# Altium schematic sheet STM32F103ZET6.SchDoc: STM32F103ZET6最小系统
size A3; CheckedBy: 罗琪; Author: 罗琪; DrawnBy: 罗琪; Engineer: 罗琪; Organization: HUNTERS; DocumentNumber: 2; Revision: 1.0; SheetNumber: 2; SheetTotal: 4; Time: 2018/11/2
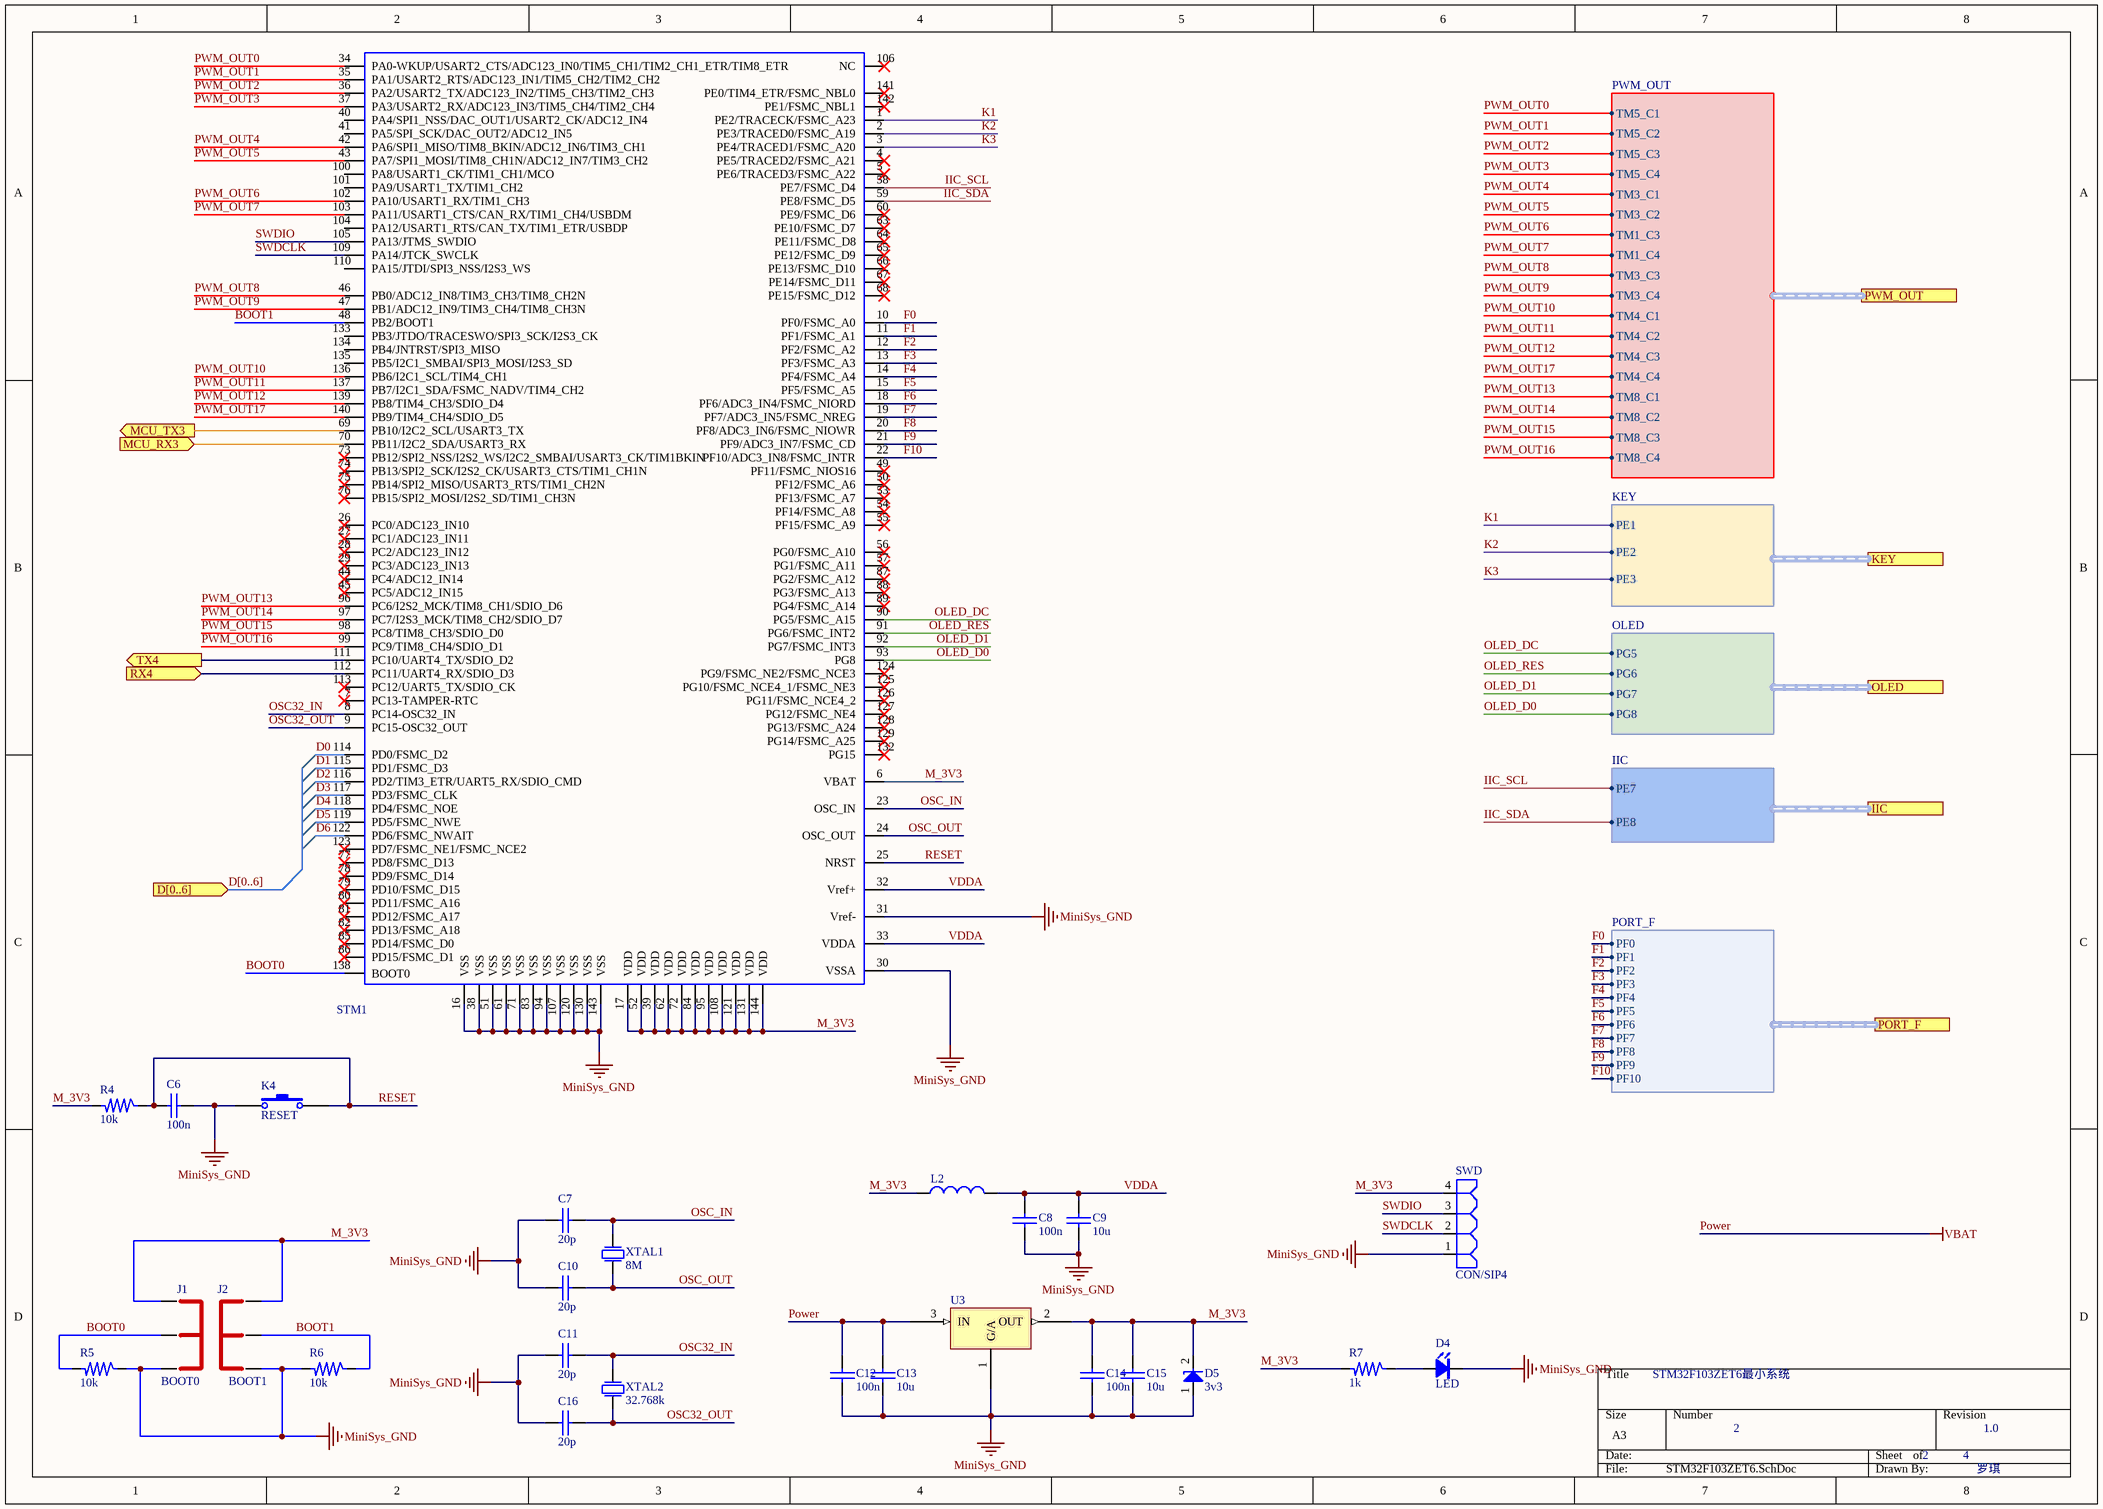
[diagram p0: STM32F103ZET6.SchDoc]

## Parts
C6  100n  [C0402]
C7  20p  [C0402]
C8  100n  [C0402]
C9  10u  [C0402]
C10  20p  [C0402]
C11  20p  [C0402]
C12  100n  [C0402]
C13  10u  [C0402]
C14  100n  [C0402]
C15  10u  [C0402]
C16  20p  [C0402]
D4  LED  [LED0805TB]
D5  3v3  [D1206]
J1  BOOT0  [Jumper3]
J2  BOOT1  [Jumper3]
K4  RESET  [按键-贴片-1]
L2  INDUCTOR  [L0805]  (value not drawn)
R4  10k  [R0805]
R5  10k  [R0805]
R6  10k  [R0805]
R7  1k  [R0805]
STM1  STM32F103ZET6  [STM32F103ZET6-1]  (value not drawn)
SWD  CON/SIP4  [HDR1X4]
U3  AMS1117-XX  [SOT223]  (value not drawn)
XTAL1  8M  [XTAL-49/S_N]
XTAL2  32.768k  [XTAL_32.768]

## Ports
D[0..6] (in), IIC (harness IIC), KEY (harness KEY), MCU_RX3 (in), MCU_TX3 (out), OLED (harness OLED), PORT_F (harness PORT_F), PWM_OUT (harness PWM_OUT), RX4 (in), TX4 (out)

## Harnesses
PWM_OUT: TM5_C1, TM5_C2, TM5_C3, TM5_C4, TM3_C1, TM3_C2, TM1_C3, TM1_C4, TM3_C3, TM3_C4, TM4_C1, TM4_C2, TM4_C3, TM8_C1, TM8_C2, TM8_C3, TM8_C4, TM4_C4
KEY: PE1, PE2, PE3
OLED: PG5, PG6, PG7, PG8
IIC: PE7, PE8
PORT_F: PF0, PF1, PF2, PF3, PF4, PF5, PF6, PF7, PF8, PF9, PF10

## Nets
MiniSys_GND: C6.2 C7.1 C8.1 C9.1 C10.1 C11.1 C12.1 C13.1 C14.1 C15.1 C16.1 D4.2(K) D5.1 J1.3 J2.1 K4.1 R5.2 R6.1 STM1.16(VSS) STM1.30(VSSA) STM1.31(Vref-) STM1.38(VSS) STM1.51(VSS) STM1.61(VSS) STM1.71(VSS) STM1.83(VSS) STM1.94(VSS) STM1.107(VSS) STM1.120(VSS) STM1.130(VSS) STM1.143(VSS) SWD.1 U3.1(G/A)
Power: C12.2 C13.2 U3.3(IN)  [also labelled VBAT]
BOOT0: J1.2 R5.1 STM1.138(BOOT0)
BOOT1: J2.2 R6.2 STM1.48(PB2/BOOT1)
D0: STM1.114(PD0/FSMC_D2)
D1: STM1.115(PD1/FSMC_D3)
D2: STM1.116(PD2/TIM3_ETR/UART5_RX/SDIO_CMD)
D3: STM1.117(PD3/FSMC_CLK)
D4: STM1.118(PD4/FSMC_NOE)
D5: STM1.119(PD5/FSMC_NWE)
D6: STM1.122(PD6/FSMC_NWAIT)
F0: STM1.10(PF0/FSMC_A0) ; port PORT_F.PF0
F1: STM1.11(PF1/FSMC_A1) ; port PORT_F.PF1
F2: STM1.12(PF2/FSMC_A2) ; port PORT_F.PF2
F3: STM1.13(PF3/FSMC_A3) ; port PORT_F.PF3
F4: STM1.14(PF4/FSMC_A4) ; port PORT_F.PF4
F5: STM1.15(PF5/FSMC_A5) ; port PORT_F.PF5
F6: STM1.18(PF6/ADC3_IN4/FSMC_NIORD) ; port PORT_F.PF6
F7: STM1.19(PF7/ADC3_IN5/FSMC_NREG) ; port PORT_F.PF7
F8: STM1.20(PF8/ADC3_IN6/FSMC_NIOWR) ; port PORT_F.PF8
F9: STM1.21(PF9/ADC3_IN7/FSMC_CD) ; port PORT_F.PF9
F10: STM1.22(PF10/ADC3_IN8/FSMC_INTR) ; port PORT_F.PF10
IIC_SCL: STM1.58(PE7/FSMC_D4) ; port IIC.PE7
IIC_SDA: STM1.59(PE8/FSMC_D5) ; port IIC.PE8
K1: STM1.1(PE2/TRACECK/FSMC_A23) ; port KEY.PE1
K2: STM1.2(PE3/TRACED0/FSMC_A19) ; port KEY.PE2
K3: STM1.3(PE4/TRACED1/FSMC_A20) ; port KEY.PE3
M_3V3: C14.2 C15.2 D5.2 J1.1 J2.3 L2.1 R4.1 R7.1 STM1.6(VBAT) STM1.17(VDD) STM1.39(VDD) STM1.52(VDD) STM1.62(VDD) STM1.72(VDD) STM1.84(VDD) STM1.95(VDD) STM1.108(VDD) STM1.121(VDD) STM1.131(VDD) STM1.144(VDD) SWD.4 U3.2(OUT)
MCU_RX3: STM1.70(PB11/I2C2_SDA/USART3_RX) ; port MCU_RX3
MCU_TX3: STM1.69(PB10/I2C2_SCL/USART3_TX) ; port MCU_TX3
OLED_D0: STM1.93(PG8) ; port OLED.PG8
OLED_D1: STM1.92(PG7/FSMC_INT3) ; port OLED.PG7
OLED_DC: STM1.90(PG5/FSMC_A15) ; port OLED.PG5
OLED_RES: STM1.91(PG6/FSMC_INT2) ; port OLED.PG6
OSC32_IN: C11.2 STM1.8(PC14-OSC32_IN) XTAL2.1(P1)
OSC32_OUT: C16.2 STM1.9(PC15-OSC32_OUT) XTAL2.2(P2)
OSC_IN: C7.2 STM1.23(OSC_IN) XTAL1.1(P1)
OSC_OUT: C10.2 STM1.24(OSC_OUT) XTAL1.2(P2)
PWM_OUT0: STM1.34(PA0-WKUP/USART2_CTS/ADC123_IN0/TIM5_CH1/TIM2_CH1_ETR/TIM8_ETR) ; port PWM_OUT.TM5_C1
PWM_OUT1: STM1.35(PA1/USART2_RTS/ADC123_IN1/TIM5_CH2/TIM2_CH2) ; port PWM_OUT.TM5_C2
PWM_OUT2: STM1.36(PA2/USART2_TX/ADC123_IN2/TIM5_CH3/TIM2_CH3) ; port PWM_OUT.TM5_C3
PWM_OUT3: STM1.37(PA3/USART2_RX/ADC123_IN3/TIM5_CH4/TIM2_CH4) ; port PWM_OUT.TM5_C4
PWM_OUT4: STM1.42(PA6/SPI1_MISO/TIM8_BKIN/ADC12_IN6/TIM3_CH1) ; port PWM_OUT.TM3_C1
PWM_OUT5: STM1.43(PA7/SPI1_MOSI/TIM8_CH1N/ADC12_IN7/TIM3_CH2) ; port PWM_OUT.TM3_C2
PWM_OUT6: STM1.102(PA10/USART1_RX/TIM1_CH3) ; port PWM_OUT.TM1_C3
PWM_OUT7: STM1.103(PA11/USART1_CTS/CAN_RX/TIM1_CH4/USBDM) ; port PWM_OUT.TM1_C4
PWM_OUT8: STM1.46(PB0/ADC12_IN8/TIM3_CH3/TIM8_CH2N) ; port PWM_OUT.TM3_C3
PWM_OUT9: STM1.47(PB1/ADC12_IN9/TIM3_CH4/TIM8_CH3N) ; port PWM_OUT.TM3_C4
PWM_OUT10: STM1.136(PB6/I2C1_SCL/TIM4_CH1) ; port PWM_OUT.TM4_C1
PWM_OUT11: STM1.137(PB7/I2C1_SDA/FSMC_NADV/TIM4_CH2) ; port PWM_OUT.TM4_C2
PWM_OUT12: STM1.139(PB8/TIM4_CH3/SDIO_D4) ; port PWM_OUT.TM4_C3
PWM_OUT13: STM1.96(PC6/I2S2_MCK/TIM8_CH1/SDIO_D6) ; port PWM_OUT.TM8_C1
PWM_OUT14: STM1.97(PC7/I2S3_MCK/TIM8_CH2/SDIO_D7) ; port PWM_OUT.TM8_C2
PWM_OUT15: STM1.98(PC8/TIM8_CH3/SDIO_D0) ; port PWM_OUT.TM8_C3
PWM_OUT16: STM1.99(PC9/TIM8_CH4/SDIO_D1) ; port PWM_OUT.TM8_C4
PWM_OUT17: STM1.140(PB9/TIM4_CH4/SDIO_D5) ; port PWM_OUT.TM4_C4
RESET: C6.1 K4.2 R4.2 STM1.25(NRST)
RX4: STM1.112(PC11/UART4_RX/SDIO_D3) ; port RX4
SWDCLK: STM1.109(PA14/JTCK_SWCLK) SWD.2
SWDIO: STM1.105(PA13/JTMS_SWDIO) SWD.3
TX4: STM1.111(PC10/UART4_TX/SDIO_D2) ; port TX4
VDDA: C8.2 C9.2 L2.2 STM1.32(Vref+) STM1.33(VDDA)
NetD4_1: D4.1(A) R7.2

Not connected (* = marked no-connect by the designer): STM1 4(PE5/TRACED2/FSMC_A21)* 5(PE6/TRACED3/FSMC_A22)* 7(PC13-TAMPER-RTC)* 26(PC0/ADC123_IN10)* 27(PC1/ADC123_IN11)* 28(PC2/ADC123_IN12)* 29(PC3/ADC123_IN13)* 40(PA4/SPI1_NSS/DAC_OUT1/USART2_CK/ADC12_IN4) 41(PA5/SPI_SCK/DAC_OUT2/ADC12_IN5) 44(PC4/ADC12_IN14)* 45(PC5/ADC12_IN15)* 49(PF11/FSMC_NIOS16)* 50(PF12/FSMC_A6)* 53(PF13/FSMC_A7)* 54(PF14/FSMC_A8)* 55(PF15/FSMC_A9)* 56(PG0/FSMC_A10)* 57(PG1/FSMC_A11)* 60(PE9/FSMC_D6)* 63(PE10/FSMC_D7)* 64(PE11/FSMC_D8)* 65(PE12/FSMC_D9)* 66(PE13/FSMC_D10)* 67(PE14/FSMC_D11)* 68(PE15/FSMC_D12)* 73(PB12/SPI2_NSS/I2S2_WS/I2C2_SMBAI/USART3_CK/TIM1BKIN)* 74(PB13/SPI2_SCK/I2S2_CK/USART3_CTS/TIM1_CH1N)* 75(PB14/SPI2_MISO/USART3_RTS/TIM1_CH2N)* 76(PB15/SPI2_MOSI/I2S2_SD/TIM1_CH3N)* 77(PD8/FSMC_D13)* 78(PD9/FSMC_D14)* 79(PD10/FSMC_D15)* 80(PD11/FSMC_A16)* 81(PD12/FSMC_A17)* 82(PD13/FSMC_A18)* 85(PD14/FSMC_D0)* 86(PD15/FSMC_D1)* 87(PG2/FSMC_A12)* 88(PG3/FSMC_A13)* 89(PG4/FSMC_A14)* 100(PA8/USART1_CK/TIM1_CH1/MCO) 101(PA9/USART1_TX/TIM1_CH2) 104(PA12/USART1_RTS/CAN_TX/TIM1_ETR/USBDP) 106(NC)* 110(PA15/JTDI/SPI3_NSS/I2S3_WS) 113(PC12/UART5_TX/SDIO_CK)* 123(PD7/FSMC_NE1/FSMC_NCE2)* 124(PG9/FSMC_NE2/FSMC_NCE3)* 125(PG10/FSMC_NCE4_1/FSMC_NE3)* 126(PG11/FSMC_NCE4_2)* 127(PG12/FSMC_NE4)* 128(PG13/FSMC_A24)* 129(PG14/FSMC_A25)* 132(PG15)* 133(PB3/JTDO/TRACESWO/SPI3_SCK/I2S3_CK) 134(PB4/JNTRST/SPI3_MISO) 135(PB5/I2C1_SMBAI/SPI3_MOSI/I2S3_SD) 141(PE0/TIM4_ETR/FSMC_NBL0)* 142(PE1/FSMC_NBL1)*

## Buses and harness runs
bus D[0..6] = port D[0..6]

## Notes on the sheet
- 4

## Library data of the parts
C6-C16 = Capacitor: 电容
D5 = DIODE稳压
J1 J2 = JUMPER3: Jumper
K4 = 按键
R4-R7 = Resistor: 电阻
U3 = AMS1117-XX: 稳压芯片
XTAL1 XTAL2 = XTAL: CRYSTAL